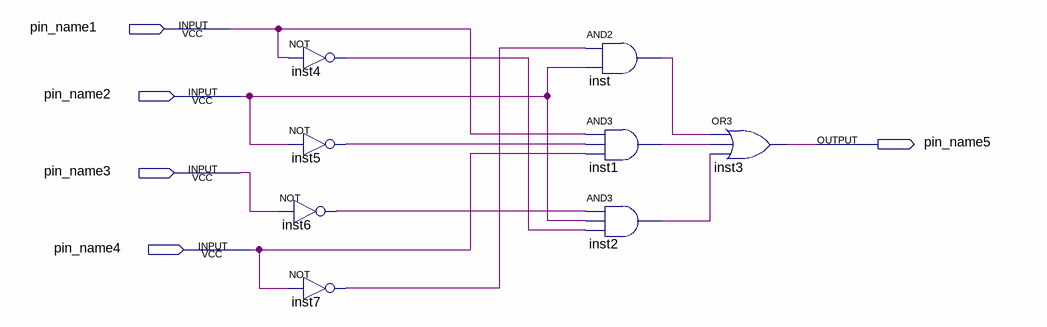
[diagram p0: schematic sheet]
// Quartus schematic l1.bdf as structural Verilog: 8 symbols, 5 pins
module l1 (
  input  pin_name1,
  input  pin_name2,
  input  pin_name3,
  input  pin_name4,
  output pin_name5
);

  wire inst1_out, inst2_out, inst4_out, inst5_out, inst6_out, inst7_out, inst_out;

  not inst4 (inst4_out, pin_name1);
  not inst5 (inst5_out, pin_name2);
  not inst6 (inst6_out, pin_name3);
  not inst7 (inst7_out, pin_name4);
  and inst (inst_out, inst7_out, pin_name2);
  and inst1 (inst1_out, pin_name1, inst5_out, pin_name4);
  and inst2 (inst2_out, inst6_out, pin_name2, inst4_out);
  or inst3 (pin_name5, inst_out, inst1_out, inst2_out);
endmodule
